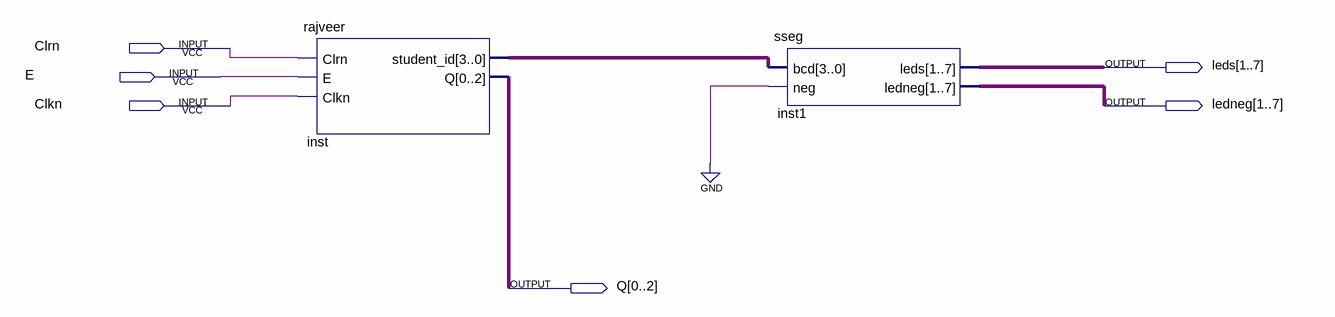
[diagram p0: schematic sheet]
// Quartus schematic johnsCounter.bdf as structural Verilog: 2 symbols, 6 pins
module johnsCounter (
  input  Clrn,
  input  E,
  input  Clkn,
  output [1:7] leds,
  output [1:7] ledneg,
  output [0:2] Q
);

  wire [3:0] inst_student_id;

  rajveer inst (.Clrn(Clrn), .E(E), .Clkn(Clkn), .student_id(inst_student_id), .Q(Q));
  sseg inst1 (.bcd(inst_student_id), .neg(1'b0), .leds(leds), .ledneg(ledneg));
endmodule
